# EasyEDA Pro project 万用表.eprj, board PCB1
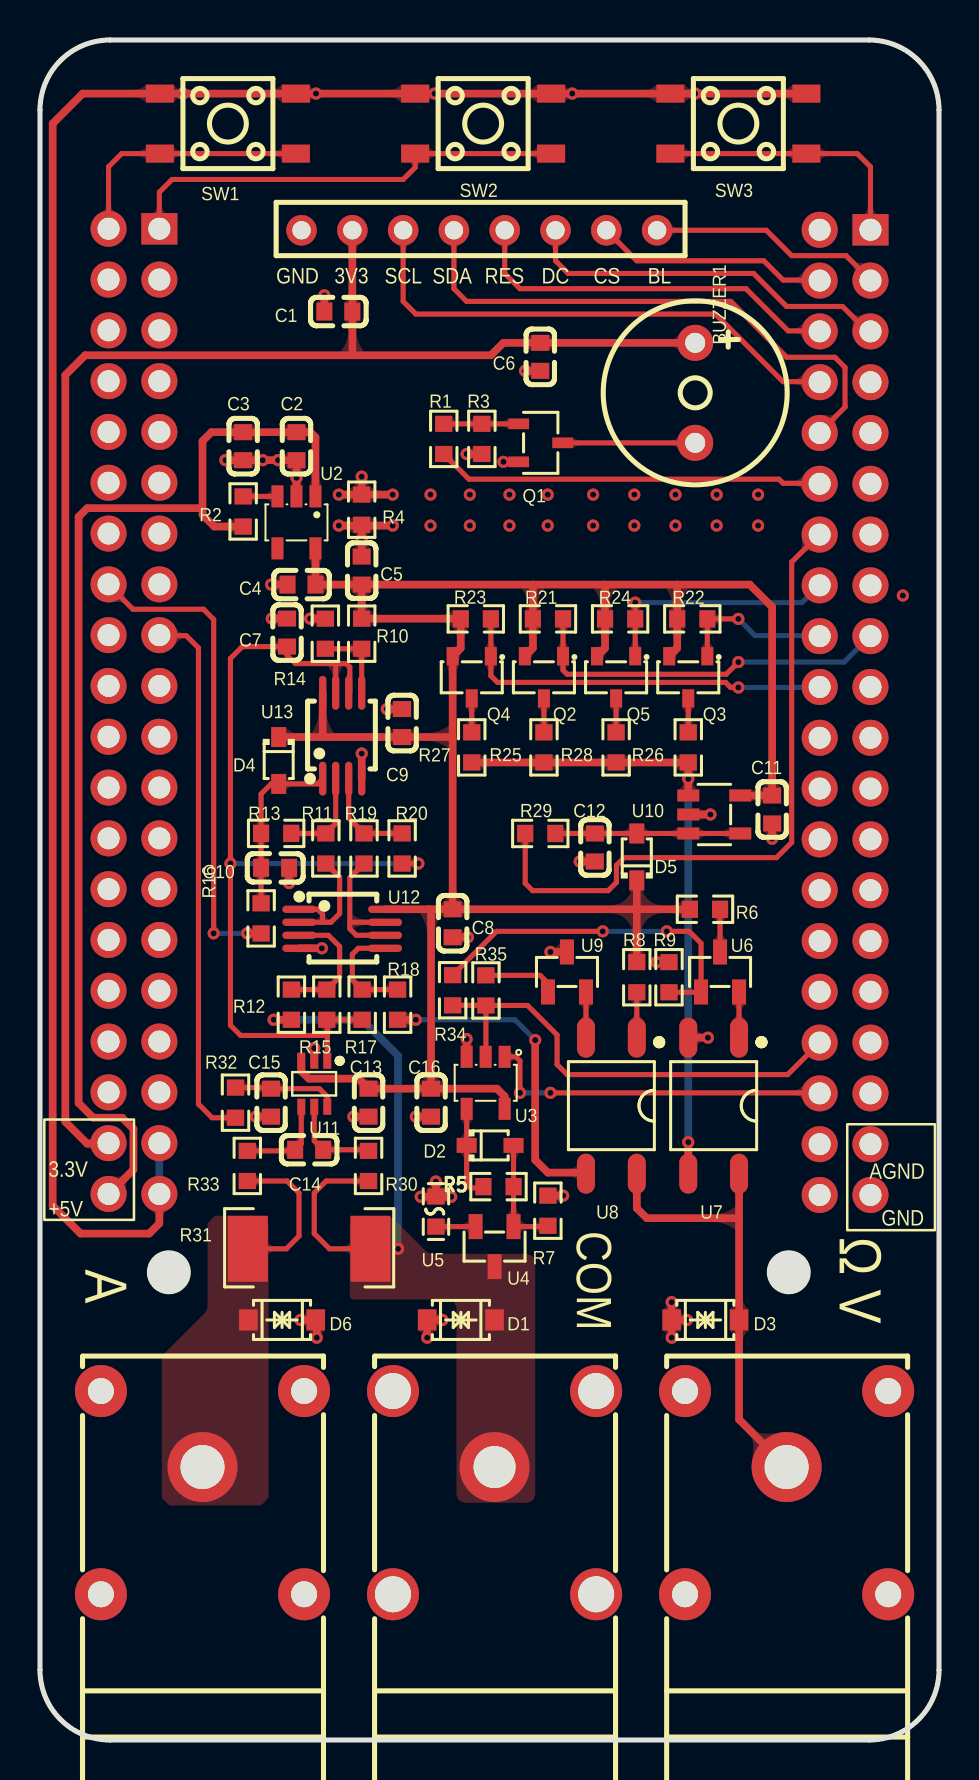
[diagram p8: board, top side]
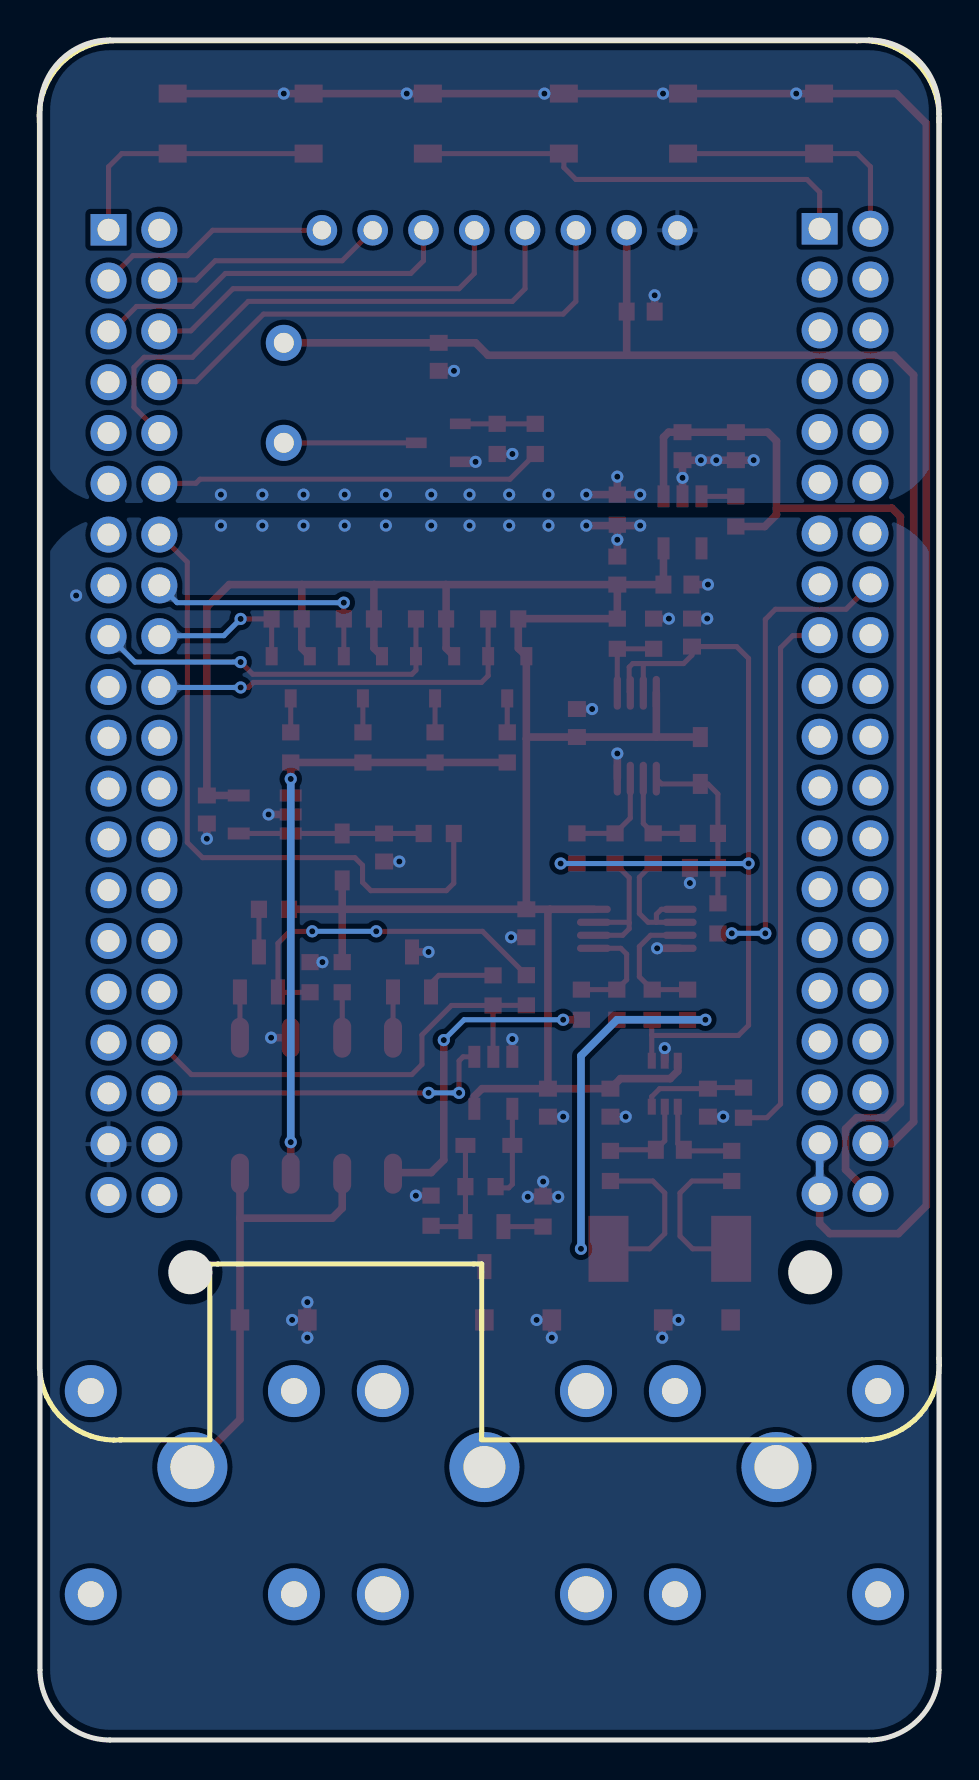
[diagram p9: board, bottom side, seen from below]

Outline 44.96 x 85 mm; copper layers: Top Layer, Bottom Layer. Coordinates in mm from the lower left corner of the outline.
Outline path: 0,81.5 0,3.5 arc(1.03,1.03) 3.5,0 41.46,0 arc(43.93,1.03) 44.96,3.5 44.96,81.5 arc(43.93,83.97) 41.46,85 3.5,85 arc(1.03,83.97) 0,81.5
Stack: Top Layer 0.035mm / Dielectric1 1.51mm FR4 er 4.5 / Bottom Layer 0.035mm

## Design rules (mm)
template: 自定义配置
spacing copperThickness1oz (default): track to track 0.152, other pairs 0.152 to 0.3
spacing copperThickness2oz: track to track 0.203, other pairs 0.152 to 0.3
track width copperThickness1oz (default): min 0.127, default 0.254, max 2.54
track width copperThickness2oz: min 0.203, default 0.254, max 2.54
track width power: min 0.127, default 0.381, max 2.54
differential pair differentialPair (default): width min 0.127, default 0.254, max 2.54; gap min 0.152, default 0.152
via viaSize (default): diameter min 0.5, default 0.61, max 10; hole min 0.3, default 0.305, max 6.299
net +D3.3V uses power
net GND uses power
net +5V uses power
net +A3V3 uses power
net AGND uses power
net VREF uses power

## Placement (name value [footprint] x y rotation side)
BUZZER1  3kHz  [BUZ-TH_BD9.0-P5.00-D0.6-FD]  32.76 67.36 270 top
C1  100nF  [C0603]  14.92 71.42 0 top
C2  1uF  [C0603]  12.83 64.69 90 top
C3  100nF  [C0603]  10.16 64.69 90 top
C4  1uF  [C0603]  13.08 57.77 0 top
C5  100nF  [C0603]  16.09 58.47 270 top
C6  100nF  [C0603]  25.02 69.16 90 top
C7  100nF  [C0603]  12.35 55.37 270 top
C8  100nF  [C0603]  20.64 40.84 90 top
C9  100nF  [C0603]  18.11 50.85 270 top
C10  100nF  [C0603]  11.76 43.61 180 top
C11  100nF  [C0603]  36.61 46.53 90 top
C12  100nF  [C0603]  27.75 44.63 90 top
C13  100nF  [C0603]  16.43 31.87 90 top
C14  100nF  [C0603]  13.46 29.51 0 top
C15  100nF  [C0603]  11.56 31.87 90 top
C16  100nF  [C0603]  19.56 31.87 90 top
CN1  24.245.1  [ANT-TH_L33.0-W12.0_RED]  37.34 12.37 90 top
CN2  24.245.2  [ANT-TH_L33.0-W12.0_BLACK]  22.73 12.37 90 top
CN3  24.245.1  [ANT-TH_L33.0-W12.0_RED]  8.13 12.37 90 top
D1  SJD12C40L01  [SOD-123_L2.8-W1.8-LS3.7-BI]  21.05 21 0 top
D2  1N5819WS  [SOD-323_L1.8-W1.3-LS2.5-RD]  22.51 29.73 0 top
D3  SJD12C40L01  [SOD-123_L2.8-W1.8-LS3.7-BI]  33.27 21 180 top
D4  1N5819WS  [SOD-323_L1.8-W1.3-LS2.5-RD]  11.94 48.97 270 top
D5  1N5819WS  [SOD-323_L1.8-W1.3-LS2.5-RD]  29.84 44.15 90 top
D6  SJD12C40L01  [SOD-123_L2.8-W1.8-LS3.7-BI]  12.1 21 180 top
EVK1  LCKFB-LSPI-SkyStar-STM32F407VET6-LITE  [COMM-TH_LCKFB-LSPI-SKYSTAR-STM32F407VET6-LITE]  22.48 51.41 180 bottom
Q1  S8050  [SOT-23-3_L3.0-W1.7-P0.95-LS2.9-BR]  25.04 64.86 180 top
Q2  AO3401  [SOT-23-3_L2.9-W1.4-P1.90-LS2.6-BR]  25.2 53.13 90 top
Q3  AO3401  [SOT-23-3_L2.9-W1.4-P1.90-LS2.6-BR]  32.42 53.13 90 top
Q4  AO3401  [SOT-23-3_L2.9-W1.4-P1.90-LS2.6-BR]  21.59 53.13 90 top
Q5  AO3401  [SOT-23-3_L2.9-W1.4-P1.90-LS2.6-BR]  28.81 53.13 90 top
R1  10kΩ  [R0603]  20.19 65.05 270 top
R2  1kΩ  [R0603]  10.16 61.43 90 top
R3  10kΩ  [R0603]  22.1 65.05 90 top
R4  0Ω  [R0603]  16.09 61.52 270 top
R5  1kΩ  [R0603]  22.93 27.67 0 top
R6  1kΩ  [R0603]  33.25 41.54 180 top
R7  10kΩ  [R0603]  25.4 26.46 270 top
R8  1kΩ  [R0603]  29.84 38.14 90 top
R9  10kΩ  [R0603]  31.45 38.14 270 top
R10  100kΩ  [R0603]  16.09 55.31 90 top
R11  100kΩ  [R0603]  14.29 44.58 90 top
R12  470kΩ  [R0603]  12.57 36.77 90 top
R13  100kΩ  [R0603]  11.81 45.33 180 top
R14  100kΩ  [R0603]  14.27 55.31 270 top
R15  22kΩ  [R0603]  14.34 36.77 90 top
R16  0Ω  [R0603]  11.06 41.08 270 top
R17  22kΩ  [R0603]  16.11 36.77 270 top
R18  470kΩ  [R0603]  17.88 36.77 90 top
R19  100kΩ  [R0603]  16.2 44.58 90 top
R20  100kΩ  [R0603]  18.11 44.58 270 top
R21  10kΩ  [R0603]  25.4 56.05 180 top
R22  10kΩ  [R0603]  32.62 56.05 180 top
R23  10kΩ  [R0603]  21.79 56.05 180 top
R24  10kΩ  [R0603]  29.01 56.05 180 top
R25  100Ω  [R0603]  25.2 49.63 90 top
R26  1kΩ  [R0603]  32.42 49.63 90 top
R27  10kΩ  [R0603]  21.59 49.63 90 top
R28  100kΩ  [R0603]  28.81 49.63 90 top
R29  0Ω  [R0603]  25.02 45.33 180 top
R30  3Ω  [R0603]  16.43 28.7 90 top
R31  10mΩ  [RES-SMD_L6.4-W3.2-R2512]  13.46 24.56 0 top
R32  0Ω  [R0603]  9.78 31.87 270 top
R33  3Ω  [R0603]  10.37 28.7 90 top
R34  1kΩ  [R0603]  20.64 37.49 270 top
R35  1kΩ  [R0603]  22.3 37.48 90 top
SW1  TS-1009S-03826  [SW-SMD_4P-L4.5-W4.5-P3.00-LS7.0_TS-1009S-03826]  9.4 80.82 180 top
SW2  TS-1009S-03826  [SW-SMD_4P-L4.5-W4.5-P3.00-LS7.0_TS-1009S-03826]  22.16 80.82 180 top
SW3  TS-1009S-03826  [SW-SMD_4P-L4.5-W4.5-P3.00-LS7.0_TS-1009S-03826]  34.92 80.82 180 top
U1  1.8寸TFT屏模块-8Pin  [1.8寸TFT屏模块-8PIN]  4.44 20.88 0 top
U2  LP5907MFX-3.3/NOPB  [SOT-23-5_L3.0-W1.7-P0.95-LS2.8-BR]  12.83 60.88 90 top
U3  SN74AHC1G08DBVR  [SOT-23-5_L3.0-W1.7-P0.95-LS2.8-BR]  22.29 32.86 90 top
U4  2N7002K  [SOT-23-3_L2.9-W1.3-P1.90-LS2.4-BL-1]  22.73 24.67 180 top
U5  BSMD0603-010-36V  [F0603]  19.8 26.42 270 top
U6  SS8050  [SOT-23-3_L2.9-W1.3-P1.90-LS2.4-BR]  34.01 38.4 270 top
U7  GAQY212GSX  [SOP-4_L4.3-W4.4-P2.54-LS6.8-TR]  33.69 31.72 0 top
U8  GAQY212GSX  [SOP-4_L4.3-W4.4-P2.54-LS6.8-TR]  28.57 31.72 0 top
U9  SS8550  [SOT-23-3_L2.9-W1.3-P1.90-LS2.4-BR]  26.35 38.4 270 top
U10  LMV321  [SOT-23-5_L2.9-W1.6-P0.95-LS2.8-TL]  33.72 46.28 0 top
U11  TP181A1-CR  [SC70-6_L2.1-W1.3-P0.65-LS2.3-BL]  13.71 32.81 180 top
U12  LMV358MM/TR  [MSOP-8_L3.0-W3.0-P0.65-LS5.0-BL]  15.11 40.56 270 top
U13  LMV358MM/TR  [MSOP-8_L3.0-W3.0-P0.65-LS5.0-BL]  15.11 50.21 0 top

## Footprints (pads in the part's own frame, mm; a bottom-side part is the same pattern mirrored in y, then rotated)
1.8寸TFT屏模块-8PIN
  round 1.524 hole 0.914: 1(8.636,54.61) 2(11.176,54.61) 3(13.716,54.61) 4(16.256,54.61) 5(18.796,54.61) 6(21.336,54.61) 7(23.876,54.61) 8(26.416,54.61)
ANT-TH_L33.0-W12.0_BLACK
  round 2.6 hole 1.8: 1(-5.08,-5.08) 2(-5.08,5.08) 3(5.08,5.08) 4(5.08,-5.08)
  round 3.5 hole 2.1: 5(1.28,0)
ANT-TH_L33.0-W12.0_RED
  round 2.6 hole 1.3: 1(-5.08,-5.08) 2(-5.08,5.08) 3(5.08,5.08) 4(5.08,-5.08)
  round 3.5 hole 2.2: 5(1.28,0)
BUZ-TH_BD9.0-P5.00-D0.6-FD
  round 1.8 hole 1: 1(-2.5,0) 2(2.5,0)
C0603
  rect 0.8x0.9 smd: 1(-0.7,0) 2(0.7,0)
COMM-TH_LCKFB-LSPI-SKYSTAR-STM32F407VET6-LITE
  rect 1.8x1.575 hole 1.1: 1(-19.05,24.105) 41(16.51,24.155)
  round 1.8 hole 1.1: 2(-16.51,24.105) 3(-19.05,21.564) 4(-16.51,21.564) 5(-19.05,19.024) 6(-16.51,19.024) 7(-19.05,16.485) 8(-16.51,16.485) 9(-19.05,13.944) 10(-16.51,13.944) 11(-19.05,11.405) 12(-16.51,11.405) 13(-19.05,8.864) 14(-16.51,8.864) 15(-19.05,6.324) 16(-16.51,6.324) 17(-19.05,3.784) 18(-16.51,3.784) 19(-19.05,1.244) 20(-16.51,1.244) 21(-19.05,-1.296) 22(-16.51,-1.296) 23(-19.05,-3.836) 24(-16.51,-3.836) 25(-19.05,-6.375) 26(-16.51,-6.375) 27(-19.05,-8.915) 28(-16.51,-8.915) 29(-19.05,-11.456) 30(-16.51,-11.456) 31(-19.05,-13.995) 32(-16.51,-13.995) 33(-19.05,-16.535) 34(-16.51,-16.535) 35(-19.05,-19.076) 36(-16.51,-19.076) 37(-19.05,-21.616) 38(-16.51,-21.616) 39(-19.05,-24.155) 40(-16.51,-24.155) 42(19.05,24.155) 43(16.51,21.616) 44(19.05,21.616) 45(16.51,19.076) 46(19.05,19.076) 47(16.51,16.535) 48(19.05,16.535) 49(16.51,13.995) 50(19.05,13.995) 51(16.51,11.456) 52(19.05,11.456) 53(16.51,8.915) 54(19.05,8.915) 55(16.51,6.375) 56(19.05,6.375) 57(16.51,3.836) 58(19.05,3.836) 59(16.51,1.296) 60(19.05,1.296) 61(16.51,-1.244) 62(19.05,-1.244) 63(16.51,-3.784) 64(19.05,-3.784) 65(16.51,-6.324) 66(19.05,-6.324) 67(16.51,-8.864) 68(19.05,-8.864) 69(16.51,-11.405) 70(19.05,-11.405) 71(16.51,-13.944) 72(19.05,-13.944) 73(16.51,-16.485) 74(19.05,-16.485) 75(16.51,-19.024) 76(19.05,-19.024) 77(16.51,-21.564) 78(19.05,-21.564) 79(16.51,-24.105) 80(19.05,-24.105)
F0603
  rect 0.806x0.864 smd: 1(-0.753,0) 2(0.753,0)
MSOP-8_L3.0-W3.0-P0.65-LS5.0-BL
  oval 0.364x1.692 smd: 1(-0.975,-2.146) 2(-0.325,-2.146) 3(0.325,-2.146) 4(0.975,-2.146) 5(0.975,2.146) 6(0.325,2.146) 7(-0.325,2.146) 8(-0.975,2.146)
R0603
  rect 0.806x0.864 smd: 1(-0.753,0) 2(0.753,0)
RES-SMD_L6.4-W3.2-R2512
  rect 2x3.3 smd: 1(-3.067,0) 2(3.067,0)
SC70-6_L2.1-W1.3-P0.65-LS2.3-BL
  rect 0.4x0.8 smd: 1(-0.65,-1.15) 2(-0.001,-1.15) 3(0.65,-1.15) 4(0.65,1.15) 5(0,1.15) 6(-0.65,1.15)
SOD-123_L2.8-W1.8-LS3.7-BI
  rect 0.93x1.06 smd: 1(1.685,0) 2(-1.685,0)
SOD-323_L1.8-W1.3-LS2.5-RD
  rect 1x0.75 smd: 1(-1.173,0) 2(1.173,0)
SOP-4_L4.3-W4.4-P2.54-LS6.8-TR
  oval 0.9x2 smd: 1(1.27,3.4) 2(-1.27,3.4) 3(-1.27,-3.4) 4(1.27,-3.4)
SOT-23-3_L2.9-W1.3-P1.90-LS2.4-BL-1
  rect 0.7x1.25 smd: 1(-0.95,-1) 2(0.95,-1) 3(0,1)
SOT-23-3_L2.9-W1.3-P1.90-LS2.4-BR
  rect 1.25x0.7 smd: 1(1,-0.95) 2(1,0.95) 3(-1,0)
SOT-23-3_L2.9-W1.4-P1.90-LS2.6-BR
  rect 0.91x0.6 smd: 1(1.055,-0.955) 2(1.055,0.955) 3(-1.055,0)
SOT-23-3_L3.0-W1.7-P0.95-LS2.9-BR
  rect 1.038x0.532 smd: 1(1.101,-0.95) 2(1.101,0.95) 3(-1.101,0)
SOT-23-5_L2.9-W1.6-P0.95-LS2.8-TL
  rect 1.1x0.6 smd: 1(-1.3,0.95) 2(-1.3,0) 3(-1.3,-0.95) 4(1.3,-0.95) 5(1.3,0.95)
SOT-23-5_L3.0-W1.7-P0.95-LS2.8-BR
  rect 1.1x0.6 smd: 1(1.3,-0.95) 2(1.3,0) 3(1.3,0.95) 4(-1.3,0.95) 5(-1.3,-0.95)
SW-SMD_4P-L4.5-W4.5-P3.00-LS7.0_TS-1009S-03826
  rect 1.4x0.9 smd: 1(-3.4,1.5) 2(3.4,1.5) 3(-3.4,-1.5) 4(3.4,-1.5)

## Nets
As in the schematic.

Pads without a net: CN1 1 2 3 4; CN2 1 2 3 4; CN3 1 2 3 4; EVK1 2 7 9 11 13 15 19 21 22 23 24 25 26 27 28 29 30 31 32 33 35 38 39 40 43 44 45 46 47 48 49 50 51 52 53 54 55 58 59 60 61 62 63 64 65 66 67 68 69 70 71 72 73 74 75 76; U2 4

## Via types
v1: diameter 0.61, hole 0.305, Top Layer to Bottom Layer, 86 vias

## Routing (per net, layer and track width the routed paths; a pad name or vN(x,y) marks a point on that pad's centre or on a via; arc(x,y) is an arc through that point)
+5V: length 57.6
  Top Layer w0.381: 8.13,61.59 8.13,61.26 8.71,60.67 R2.1 ; 8.13,61.59 2.36,61.59 1.93,61.16 1.93,31.85 2.66,31.11 4.11,31.11 4.67,30.55 4.67,28.52 3.43,27.28 ; 8.13,61.59 8.13,64.94 8.57,65.39 C3.2 C2.2 13.52,65.39 13.78,65.14 U2.1
+A3V3: length 119.9
  Top Layer w0.381: U10.5 C11.2 36.61,56.65 35.49,57.77 31.87,57.77 ; 27.85,54.19 28.26,54.59 R24.2 28.26,57.75 28.24,57.77 ; U3.5 23.24,32.18 22.85,32.57 C16.2 ; D5.1 29.84,41.54 ; 29.84,41.54 R6.2 ; 29.84,41.54 29.84,41.45 ; 19.46,41.54 C8.2 ; 19.46,41.54 19.56,41.44 C16.2 ; 19.46,41.54 U12.8 ; C8.2 20.64,50.07 ; C8.2 29.76,41.54 29.84,41.45 ; R8.2 29.84,41.45 ; 28.24,57.77 31.87,57.77 ; 28.24,57.77 24.67,57.77 ; 31.87,57.77 R22.2 31.87,54.59 Q3.2 ; Q2.2 24.65,54.59 24.65,57.75 24.67,57.77 ; 20.64,50.07 20.56,50.15 C9.2 14.14,50.15 ; 20.64,50.07 Q4.2 21.04,54.59 R23.2 21.03,56.07 16.09,56.07 C5.2 ; C16.2 C13.2 15.93,33.07 13.44,33.07 13.06,33.44 13.06,33.96 ; C5.2 C4.2 13.78,59.58 U2.5 ; C5.2 24.67,57.77 ; 14.14,50.15 U13.8 ; 14.14,50.15 11.94,50.15
+D3.3V: length 78.4
  Top Layer w0.381: 3.43,29.82 2.36,29.82 1.27,30.91 1.27,68.25 2.26,69.24 15.62,69.24 ; 15.62,69.24 22.55,69.24 23.17,69.86 C6.2 BUZZER1.1 ; 15.62,69.24 C1.2 U1.2
AGND: length 29.1
  Top Layer w0.381: C15.1 v1(10.79,31.17) ; 19.8,27.16 v1(19.04,27.16) ; 19.8,27.16 v1(20.56,27.16) ; 19.8,27.16 v1(19.8,27.92) ; C13.1 v1(15.67,31.17) ; v1(19.36,20.11) D1.2 v1(20.12,21) ; v1(14.94,60.72) 16.05,60.72 R4.2 ; D3.1 v1(31.59,20.11) ; D3.1 v1(31.59,21.89) ; D3.1 v1(32.35,21) ; R4.2 16.13,60.72 v1(17.64,60.72) ; R4.2 v1(16.09,60.01) C5.1 ; U13.4 v1(16.09,49.32) ; C12.1 v1(26.99,43.93) ; C8.1 v1(21.4,40.14) ; U7.2 v1(33.4,35.12) ; C9.1 v1(17.35,51.55) ; U12.4 v1(14.1,39.59) ; 14.27,56.07 v1(13.51,56.07) ; U3.3 v1(21.34,35.05) ; C16.1 v1(18.79,31.17) ; v1(13.84,20.11) 13.84,20.95 D6.2 v1(13.03,21) ; R9.1 v1(30.83,38.89) ; 12.35,56.07 v1(11.59,56.07) ; 13.72,33.96 v1(13.72,34.59) ; C10.1 v1(12.46,42.85) ; U9.3 v1(25.53,39.4) ; C11.1 v1(36.61,45.06) ; 32.42,46.28 v1(33.53,46.28) ; C4.1 v1(11.56,57.77) ; 25.4,27.22 v1(26.16,27.22)
  vias: v1(19.53,60.72) v1(21.5,60.72) v1(23.48,60.72) v1(25.39,60.72) v1(27.66,60.72) v1(29.72,60.72) v1(31.78,60.72) v1(33.84,60.72) v1(35.91,60.72) v1(43.15,57.22)
GND: length 114.6
  Top Layer w0.381: 16.09,62.27 v1(14.94,62.27) ; 16.09,62.27 v1(17.64,62.27) ; 16.09,62.27 v1(16.09,63.17) ; v1(9.27,63.99) C3.1 v1(11.14,63.99) v1(11.91,63.99) C2.1 v1(12.83,63.11) U2.2 ; C1.1 v1(14.22,72.23) ; Q1.2 v1(23.18,63.91) ; R3.1 v1(21.33,64.3) ; 5.97,27.28 5.97,25.83 5.46,25.32 2.03,25.32 0.63,26.72 0.63,80.82 2.13,82.32 SW1.4 v1(7.14,82.32) SW1.3 v1(13.8,82.32) SW2.4 v1(19.73,82.32) SW2.3 v1(26.62,82.32) SW3.4 v1(32.77,82.32) SW3.3 ; C6.1 v1(24.26,68.46)
  Bottom Layer w0.381: 5.97,27.28 5.97,29.82
  vias: v1(19.53,62.27) v1(21.5,62.27) v1(23.48,62.27) v1(25.39,62.27) v1(27.66,62.27) v1(29.72,62.27) v1(31.78,62.27) v1(33.84,62.27) v1(35.91,62.27)
BLACK_CON: length 17.4
  Top Layer w0.254: U3.1 23.8,34.16 24,33.96 v1(24,32.36) ; 38.99,32.36 v1(25.53,32.36)
  Bottom Layer w0.254: v1(24,32.36) v1(25.53,32.36)
BLACK_PIN: length 25.6
  Top Layer w0.254: R31.2 14.48,24.56 13.71,25.32 13.71,27.35 14.31,27.95 R30.1
  Top Layer w0.381: R12.1 v1(11.68,36.01)
  Bottom Layer w0.381: v1(17.91,24.56) 17.91,34.21 16.1,36.01 v1(11.68,36.01)
BUZZER: length 19.4
  Top Layer w0.254: R1.2 21.45,63.04 36.96,63.04 37.16,62.84 38.99,62.84
CON_1K: length 7.8
  Top Layer w0.254: v1(34.92,56.05) R22.1 Q3.1
  Bottom Layer w0.254: v1(34.92,56.05) 35.76,55.22 38.99,55.22
CON_10K: length 19.5
  Top Layer w0.254: R23.1 Q4.1 22.55,53.21 22.88,52.88 34.29,52.88 34.54,52.63 v1(34.92,52.63)
  Bottom Layer w0.254: 38.99,52.68 38.94,52.63 v1(34.92,52.63)
CON_100K: length 12.3
  Top Layer w0.254: v1(29.76,56.87) R24.1 Q5.1
  Bottom Layer w0.254: 38.99,57.76 38.1,56.87 v1(29.76,56.87)
CON_100R: length 18.8
  Top Layer w0.254: v1(34.92,53.9) 34.31,53.29 26.36,53.29 26.16,53.49 Q2.1 R21.1
  Bottom Layer w0.254: v1(34.92,53.9) 40.21,53.9 41.53,55.22
ELECTRICITY_PIN: length 27.2
  Top Layer w0.254: 9.78,31.11 8.61,31.11 7.92,31.8 7.92,54.61 7.31,55.22 5.97,55.22
KEY1: length 12.8
  Top Layer w0.254: 3.43,75.54 3.43,78.66 4.09,79.32 SW1.2 SW1.1
KEY2: length 22.7
  Top Layer w0.254: SW2.1 SW2.2 18.76,78.63 18.16,78.03 6.6,78.03 5.97,77.39 5.97,75.54
KEY3: length 13.4
  Top Layer w0.254: SW3.2 SW3.1 40.87,79.32 41.53,78.66 41.53,75.54
PB1/ADC9: length 23.9
  Top Layer w0.254: 22.3,36.73 22.29,36.73 R34.2 ; 22.3,36.73 24.38,36.73 25.86,35.25 25.86,33.78 26.36,33.27 37.39,33.27 EVK1.34 ; 22.3,36.73 22.3,34.17 U3.2
RES_VCC: length 32.2
  Top Layer w0.381: 32.42,28.32 v1(32.42,29.89) ; U10.1 v1(32.42,48.05) R26.1 R28.1 R25.1 R27.1
  Bottom Layer w0.381: v1(32.42,29.89) v1(32.42,48.05)
RESISTANCE_PIN: length 33.5
  Top Layer w0.254: 38.99,60.3 37.59,58.9 37.59,44.88 36.83,44.12 29.21,44.12 28.83,43.74 28.83,42.88 28.41,42.47 24.64,42.47 24.26,42.84 24.26,45.33
SPI_BL: length 11.7
  Top Layer w0.254: U1.8 36.32,75.49 37.59,74.22 40.31,74.22 41.53,73
SPI_CS: length 11.7
  Top Layer w0.254: 38.99,73 37.16,73 36.19,73.96 29.84,73.96 U1.7
SPI_DC: length 18.7
  Top Layer w0.254: 41.53,70.46 41.35,70.46 40.13,71.68 37.34,71.68 35.69,73.33 26.41,73.33 25.78,73.96 U1.6
SPI_RES: length 19.1
  Top Layer w0.254: U1.5 23.24,73.33 24,72.56 35.3,72.56 37.41,70.46 38.99,70.46
SPI_SCL: length 26
  Top Layer w0.254: U1.3 18.16,71.93 18.79,71.29 33.78,71.29 37.16,67.92 38.99,67.92
SPI_SDA: length 27.9
  Top Layer w0.254: 38.99,65.38 40.26,66.65 40.26,68.63 39.75,69.14 37.34,69.14 34.54,71.93 21.33,71.93 20.7,72.56 U1.4
VOL_VCC: length 16.1
  Top Layer w0.381: 27.3,28.32 27.25,28.37 25.4,28.37 24.76,29 v1(24.76,35) ; v1(18.79,36.01) R18.1
  Bottom Layer w0.254: v1(18.79,36.01) 23.75,36.01 v1(24.76,35)
VOLTAGE_PIN: length 24
  Top Layer w0.254: v1(8.69,40.33) 8.69,56.03 8.18,56.54 4.65,56.54 3.43,57.76 ; R16.2 11.05,40.33 v1(10.36,40.33)
  Bottom Layer w0.254: v1(8.69,40.33) v1(10.36,40.33)
VREF: length 47.1
  Top Layer w0.254: 14.76,53.82 15.31,53.82 15.49,53.64 15.49,52.41 U13.6 ; 14.76,53.82 14.79,53.79 U13.7 ; 14.76,53.82 12.77,53.82 12.35,54.24 C7.2 10.12,54.67 9.52,54.08 v1(9.52,43.82) 9.52,35.73 10.03,35.23 14.35,35.23 14.36,35.24 ; R20.2 v1(18.92,43.82) ; 14.36,33.96 14.36,35.24 ; 14.36,35.24 14.36,35.99 R15.1 R17.2
  Bottom Layer w0.254: v1(18.92,43.82) v1(9.52,43.82)
$2N583: length 1.7
  Top Layer w0.254: R2.2 U2.3
$2N837: length 3.7
  Top Layer w0.254: Q1.1 R3.2 R1.1
$2N838: length 6.6
  Top Layer w0.254: Q1.3 BUZZER1.2
$3N409: length 4.7
  Top Layer w0.254: U3.4 D2.1 21.34,27.79 21.52,27.61 22.11,27.61 R5.1
$3N410: length 5.8
  Top Layer w0.254: R7.2 25.36,25.67 U4.1 R5.2 D2.2
$3N411: length 2
  Top Layer w0.254: U5.2 U4.2
$3N879: length 22.7
  Top Layer w0.381: 34.96,26.09 30.34,26.09 29.84,26.59 29.84,28.32 ; 34.96,26.09 34.96,28.32 ; 34.96,26.09 D3.2 34.96,16.03 CN1.5
$3N885: length 2.3
  Top Layer w0.254: R8.1 U8.1
$3N889: length 2.3
  Top Layer w0.254: U7.1 U6.2
$3N891: length 2.1
  Top Layer w0.254: R6.1 U6.3
$3N894: length 2.3
  Top Layer w0.254: U9.2 U8.2
$3N4515: length 17.6
  Top Layer w0.254: R9.2 33.04,37.39 33.06,37.4 33.06,39.84 32.46,40.43 v1(31.34,40.43) ; R34.1 22.83,40.43 v1(28.14,40.43)
  Bottom Layer w0.254: v1(28.14,40.43) v1(31.34,40.43)
$3N4596: length 3.7
  Top Layer w0.254: U9.1 25.4,37.84 25.01,38.23 R35.2
$4N965: length 6.4
  Top Layer w0.254: 12.97,40.24 14.42,40.24 14.98,39.67 14.98,38.16 R15.2 R12.2
$4N967: length 5.5
  Top Layer w0.254: U12.5 15.91,39.59 15.62,39.29 15.62,38.01 R17.1 R18.2
$4N971: length 7.2
  Top Layer w0.254: 15.49,40.85 15.52,40.89 U12.7 ; 15.49,40.85 15.49,40.56 15.82,40.24 17.26,40.24 ; 15.49,40.85 15.49,43.12 R19.1
$4N972: length 6.7
  Top Layer w0.254: U12.2 14.13,40.89 ; 14.13,40.89 14.13,41.29 13.88,41.54 U12.1 ; 14.13,40.89 14.55,40.89 14.98,41.32 14.98,43.13 R11.1
$4N973: length 4.7
  Top Layer w0.254: R13.1 R11.2 14.79,45.82 U13.2
$4N974: length 5
  Top Layer w0.254: U13.3 15.44,46.1 R19.2 R20.1
$4N985: length 4
  Top Layer w0.254: U13.5 R10.1 R14.2
$4N994: length 8.9
  Top Layer w0.254: R16.1 C10.2 11.06,47.3 11.56,47.8 D4.2 13.87,47.8 U13.1
$4N1465: length 4.7
  Top Layer w0.254: R33.2 12.71,29.46 C14.1 13.06,29.82 U11.4
$4N1466: length 7.8
  Top Layer w0.254: R33.1 12.36,27.95 12.95,27.35 12.95,25.19 12.32,24.56 R31.1
$4N1467: length 4.6
  Top Layer w0.254: U11.5 13.71,29.96 C14.2 16.38,29.51 R30.2
$4N1481: length 5.3
  Top Layer w0.254: R32.1 11.5,32.62 C15.2 13.97,32.57 14.36,32.17 U11.6
$4N2338: length 1.7
  Top Layer w0.254: R25.2 Q2.3
$4N2342: length 1.7
  Top Layer w0.254: R26.2 Q3.3
$4N2344: length 1.7
  Top Layer w0.254: Q4.3 R27.2
$4N2348: length 1.7
  Top Layer w0.254: R28.2 Q5.3
$4N2381: length 9.2
  Top Layer w0.254: R29.1 C12.2 D5.2 U10.3 U10.4

## Copper pours and planes (outline as drawn; the poured copper is in the pictures)
AGND on Bottom Layer: 0,57.62 0.02,57.95 0.07,58.32 0.16,58.68 0.29,59.03 0.46,59.36 0.66,59.67 0.9,59.96 1.16,60.23 1.45,60.46 1.76,60.66 2.1,60.83 2.45,60.96 2.81,61.05 3.17,61.11 3.5,61.12 41.46,61.12 41.78,61.11 42.15,61.05 42.51,60.96 42.86,60.83 43.19,60.66 43.51,60.46 43.8,60.23 44.06,59.96 44.29,59.67 44.5,59.36 44.66,59.03 44.79,58.68 44.89,58.32 44.94,57.95 44.96,57.62 44.96,3.5 44.94,3.17 44.89,2.81 44.79,2.45 44.66,2.1 44.5,1.76 44.29,1.45 44.06,1.16 43.8,0.9 43.51,0.66 43.19,0.46 42.86,0.29 42.51,0.16 42.15,0.07 41.78,0.02 41.46,0 3.5,0 3.17,0.02 2.81,0.07 2.45,0.16 2.1,0.29 1.76,0.46 1.45,0.66 1.16,0.9 0.9,1.16 0.66,1.45 0.46,1.76 0.29,2.1 0.16,2.45 0.07,2.81 0.02,3.17 0,3.5
GND on Bottom Layer: 44.96,65.35 44.94,65.02 44.89,64.65 44.79,64.29 44.66,63.95 44.5,63.61 44.29,63.3 44.06,63.01 43.8,62.75 43.51,62.51 43.19,62.31 42.86,62.14 42.51,62.01 42.15,61.92 41.78,61.86 41.46,61.85 3.5,61.85 3.17,61.86 2.81,61.92 2.45,62.01 2.1,62.14 1.76,62.31 1.45,62.51 1.16,62.75 0.9,63.01 0.66,63.3 0.46,63.61 0.29,63.95 0.16,64.29 0.07,64.65 0.02,65.02 0,65.35 0,81.5 0.02,81.83 0.07,82.19 0.16,82.55 0.29,82.9 0.46,83.24 0.66,83.55 0.9,83.84 1.16,84.1 1.45,84.34 1.76,84.54 2.1,84.71 2.45,84.84 2.81,84.93 3.17,84.98 3.5,85 41.46,85 41.78,84.98 42.15,84.93 42.51,84.84 42.86,84.71 43.19,84.54 43.51,84.34 43.8,84.1 44.06,83.84 44.29,83.55 44.5,83.24 44.66,82.9 44.79,82.55 44.89,82.19 44.94,81.83 44.96,81.5
BLACK_PIN on Top Layer: 15.49,26.21 24.76,26.21 24.76,11.86 15.49,11.86
$4N1466 on Top Layer: 6.09,26.21 11.43,26.21 11.43,11.73 6.09,11.73

Small or netless copper shapes (teardrops, artwork), in the pictures only: 349 on Top Layer, 20 on Bottom Layer

## Text on the board
Top Silkscreen Layer: 3.3V | +5V | GND | 3V3 | SCL | SDA | RES | DC | CS | BL | AGND | COM | A | Ω V
